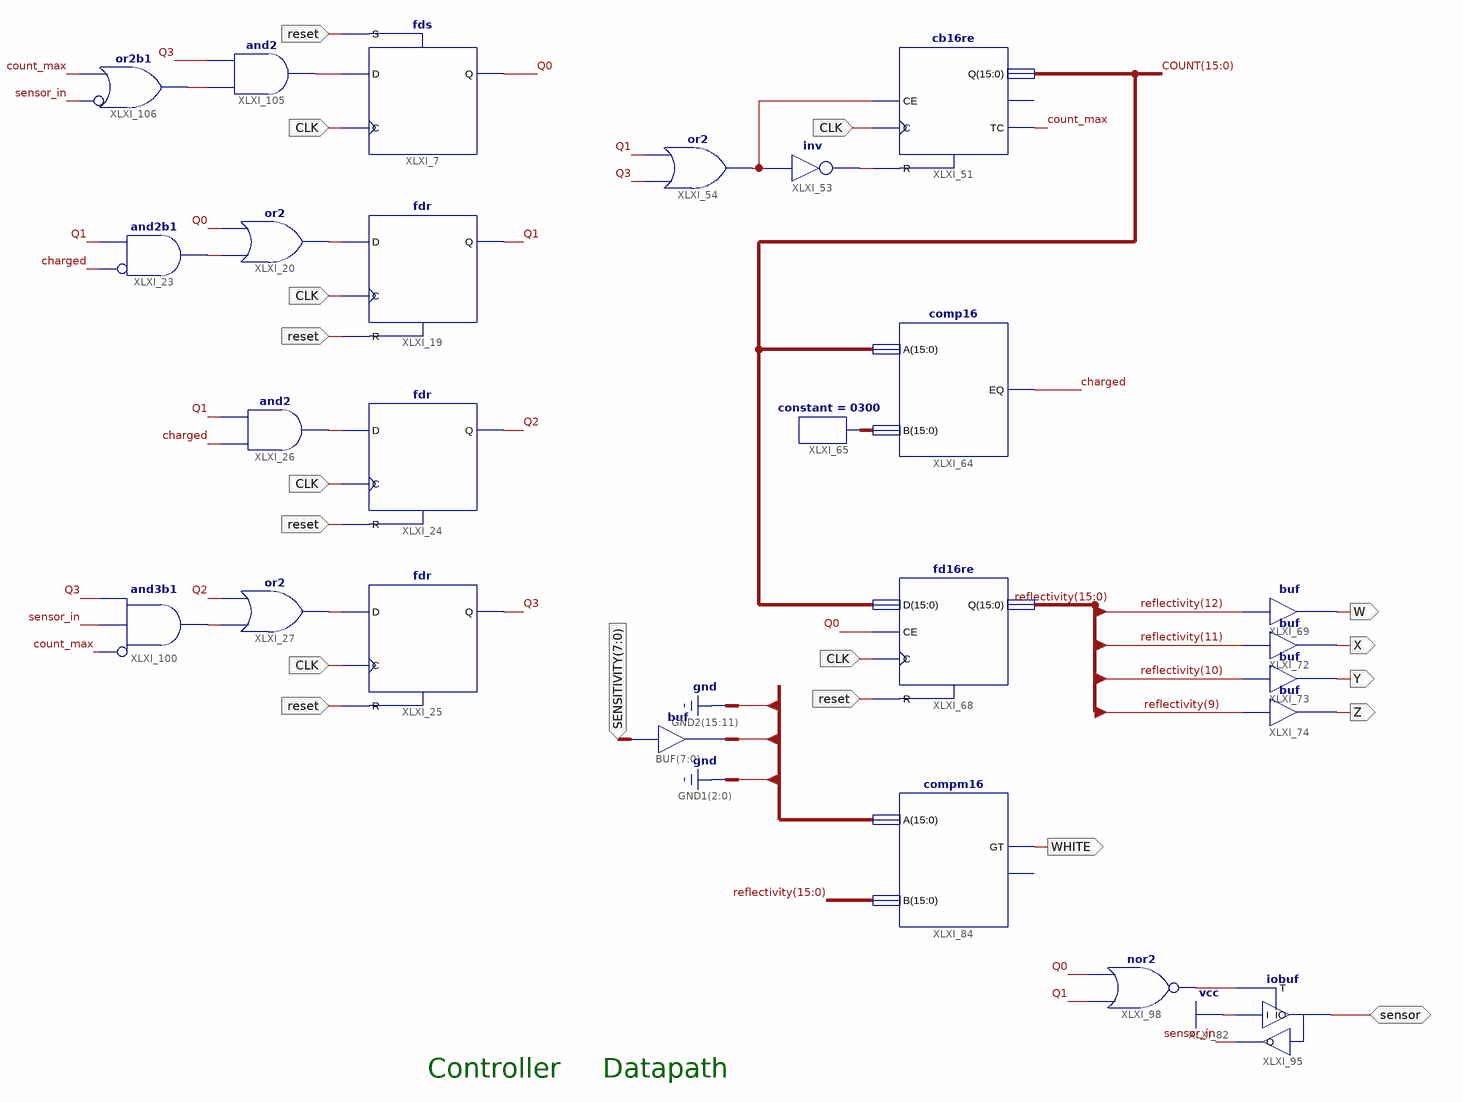
[diagram p0: schematic sheet 1]
// Xilinx ISE schematic light_sensor_interface.sch (spartan3e) as structural Verilog: 25 symbols, 9 ports
module light_sensor_interface (
  input  CLK,
  input  reset,
  input  [7:0] SENSITIVITY,
  inout  sensor,
  output W,
  output X,
  output Y,
  output Z,
  output WHITE
);

  wire a_wire, charged, count_max, Q0, Q1, Q2, Q3, sensor_in, XLXN_1, XLXN_31, XLXN_33, XLXN_34, XLXN_35,
       XLXN_36, XLXN_113, XLXN_120, XLXN_173;
  wire [10:3] COMP_SENS;
  wire [15:0] COUNT, reflectivity, XLXN_139;

  or XLXI_20 (XLXN_31, XLXN_33, Q0);
  and XLXI_23 (XLXN_33, ~charged, Q1);  // and2b1
  and XLXI_26 (XLXN_34, charged, Q1);
  or XLXI_27 (XLXN_35, XLXN_36, Q2);
  fds XLXI_7 (.C(CLK), .D(XLXN_1), .S(reset), .Q(Q0));
  fdr XLXI_25 (.C(CLK), .D(XLXN_35), .R(reset), .Q(Q3));
  fdr XLXI_24 (.C(CLK), .D(XLXN_34), .R(reset), .Q(Q2));
  fdr XLXI_19 (.C(CLK), .D(XLXN_31), .R(reset), .Q(Q1));
  or XLXI_54 (XLXN_120, Q3, Q1);
  not XLXI_53 (XLXN_113, XLXN_120);
  cb16re XLXI_51 (.C(CLK), .CE(XLXN_120), .R(XLXN_113), .Q(COUNT), .TC(count_max));  // open: CEO
  constant #(.CValue("0300")) XLXI_65 (.O(XLXN_139));
  comp16 XLXI_64 (.A(COUNT), .B(XLXN_139), .EQ(charged));
  fd16re XLXI_68 (.C(CLK), .CE(Q0), .D(COUNT), .R(reset), .Q(reflectivity));
  buf XLXI_69 (W, reflectivity[12]);
  buf XLXI_72 (X, reflectivity[11]);
  buf XLXI_73 (Y, reflectivity[10]);
  buf XLXI_74 (Z, reflectivity[9]);
  compm16 XLXI_84 (.A({{5{1'b0}}, COMP_SENS, 3'b000}), .B(reflectivity), .GT(WHITE));  // open: LT
  assign COMP_SENS = SENSITIVITY;  // buf BUF[7..0], 8 bits wide
  iobuf XLXI_95 (.I(1'b1), .IO(sensor), .O(sensor_in), .T(XLXN_173));
  nor XLXI_98 (XLXN_173, Q1, Q0);
  and XLXI_100 (XLXN_36, ~count_max, sensor_in, Q3);  // and3b1
  and XLXI_105 (XLXN_1, a_wire, Q3);
  or XLXI_106 (a_wire, ~sensor_in, count_max);  // or2b1

  // Notes on the sheet:
  //   Controller
  //   Datapath
endmodule
